# EasyEDA schematic Sheet_1.json
TITLE: Sheet_1; REV: 1.0; Date: 2023-06-02; Sheet: 1/1; Drawn By: Huanbaejh; Company: Your Company
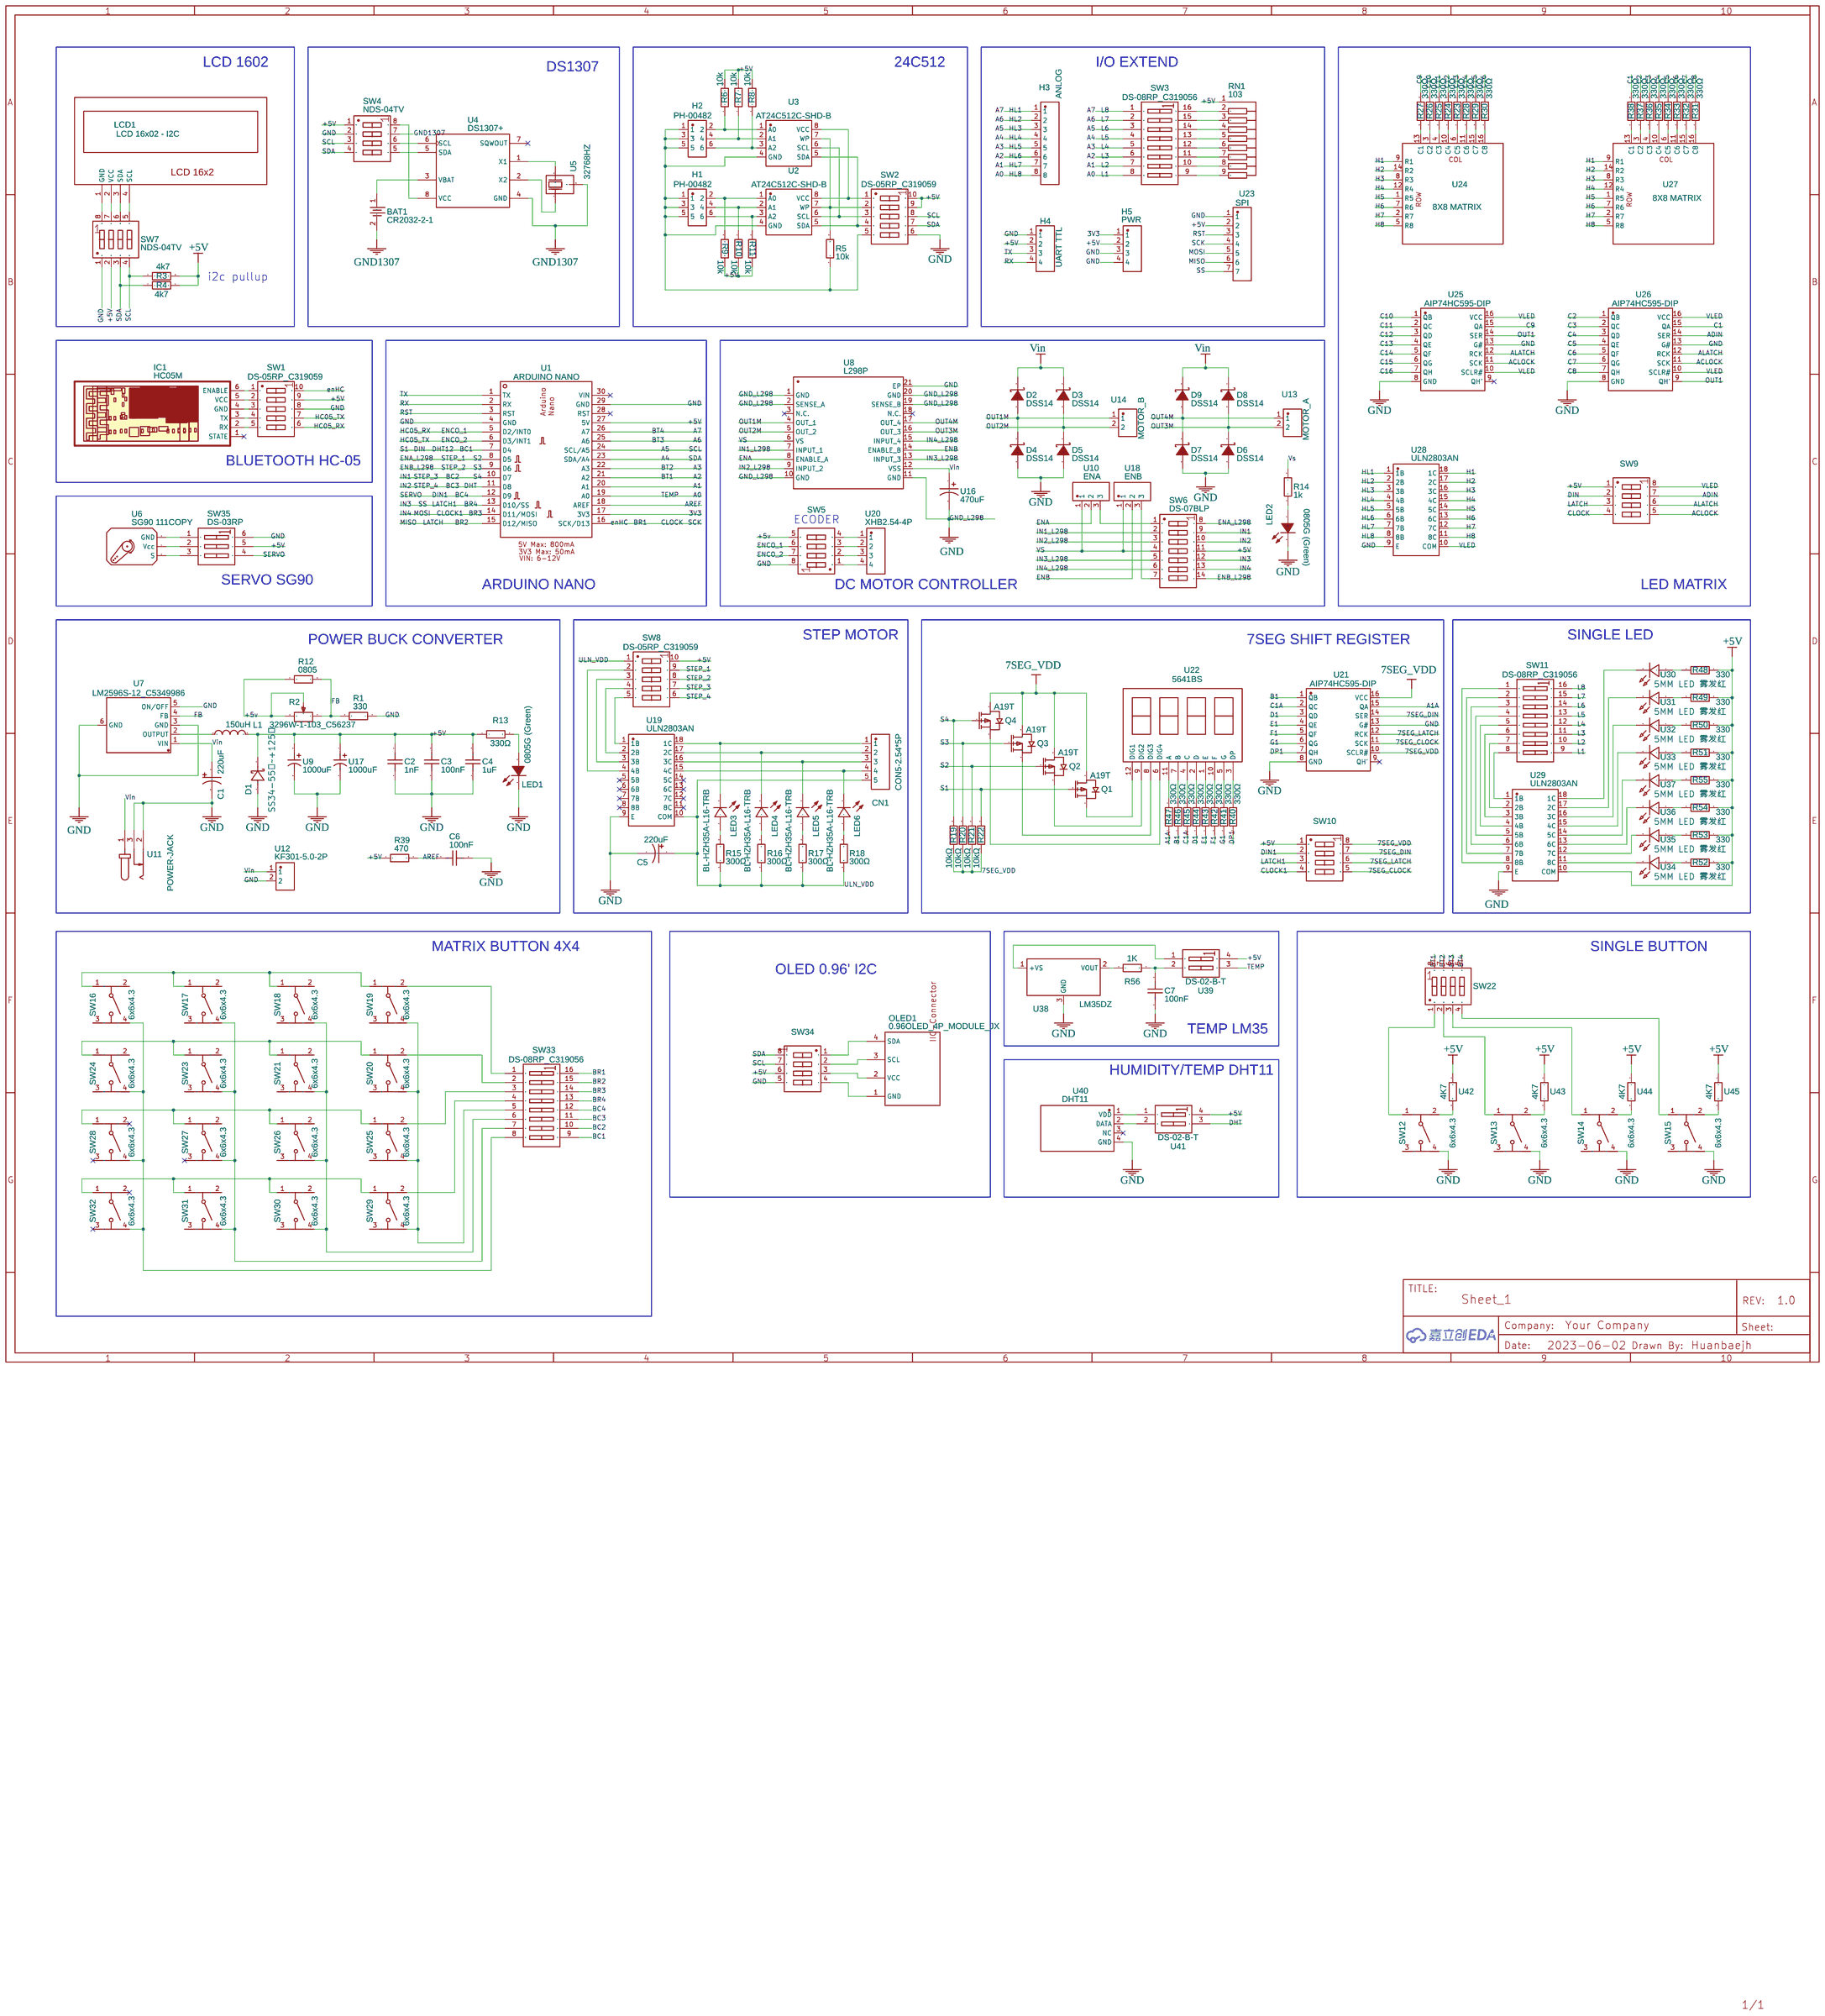
[diagram p0: schematic sheet]

## Parts
BAT1  CR2032-2-1  [BAT-TH_CR2032-2-1]
C1  220uF  [CAP-SMD_BD12.5-L13.0-W13.0-LS13.7-FD]
C2  1nF  [C0805]
C3  100nF  [C0805]
C4  1uF  [C0805]
C5  220uF  [CAP-SMD_BD10.0-L10.3-W10.3-FD]
C6  100nF  [C0805]
C7  100nF  [C0805]
CN1  CON5-2.54*5P  [CONN-TH_5P-P2.54-V]
D1  SS34-55℃~+125℃  [SMA_L4.3-W2.6-LS5.1-RD]
D2  DSS14  [SOD-123_L2.8-W1.8-LS3.7-RD]
D3  DSS14  [SOD-123_L2.8-W1.8-LS3.7-RD]
D4  DSS14  [SOD-123_L2.8-W1.8-LS3.7-RD]
D5  DSS14  [SOD-123_L2.8-W1.8-LS3.7-RD]
D6  DSS14  [SOD-123_L2.8-W1.8-LS3.7-RD]
D7  DSS14  [SOD-123_L2.8-W1.8-LS3.7-RD]
D8  DSS14  [SOD-123_L2.8-W1.8-LS3.7-RD]
D9  DSS14  [SOD-123_L2.8-W1.8-LS3.7-RD]
H1  PH-00482  [HDR-TH_6P-P2.54-V-M-R2-C3-S2.54]
H2  PH-00482  [HDR-TH_6P-P2.54-V-M-R2-C3-S2.54]
H3  ANLOG  [HDR-TH_8P-P2.54-V-M]
H4  UART TTL  [HDR-TH_4P-P2.54-V-F]
H5  PWR  [HDR-TH_4P-P2.54-V-M]
IC1  HC05M  [HC05M]
L1  150uH  [IND-SMD_L12.5-W12.5]
LCD1  LCD 16x02 - I2C  [LCD1602-I2C]
LED1  0805G (Green)  [LED0805-R-RD]
LED2  0805G (Green)  [LED0805-R-RD]
LED3  BL-HZH35A-L16-TRB  [LED0805-R-RD]
LED4  BL-HZH35A-L16-TRB  [LED0805-R-RD]
LED5  BL-HZH35A-L16-TRB  [LED0805-R-RD]
LED6  BL-HZH35A-L16-TRB  [LED0805-R-RD]
OLED1  0.96OLED_4P_MODULE_JX  [0.96OLED_4P]
Q1  A19T  [SOT-23-3_L2.9-W1.3-P1.90-LS2.4-BR]
Q2  A19T  [SOT-23-3_L2.9-W1.3-P1.90-LS2.4-BR]
Q3  A19T  [SOT-23-3_L2.9-W1.3-P1.90-LS2.4-BR]
Q4  A19T  [SOT-23-3_L2.9-W1.3-P1.90-LS2.4-BR]
R1  330  [R0805]
R2  3296W-1-103_C56237  [RES-ADJ-TH_3296W]
R3  4k7  [R0805]
R4  4k7  [R0805]
R5  10k  [R0805]
R6  10k  [R0805]
R7  10k  [R0805]
R8  10k  [R0805]
R9  10k  [R0805]
R10  10k  [R0805]
R11  10k  [R0805]
R12  0805  [R0805]
R13  330Ω  [R0805]
R14  1k  [R0805]
R15  300Ω  [R0805]
R16  300Ω  [R0805]
R17  300Ω  [R0805]
R18  300Ω  [R0805]
R19  10kΩ  [R0805]
R20  10kΩ  [R0805]
R21  10kΩ  [R0805]
R22  10kΩ  [R0805]
R23  330Ω  [R0805]
R24  330Ω  [R0805]
R25  330Ω  [R0805]
R26  330Ω  [R0805]
R27  330Ω  [R0805]
R28  330Ω  [R0805]
R29  330Ω  [R0805]
R30  330Ω  [R0805]
R31  330Ω  [R0805]
R32  330Ω  [R0805]
R33  330Ω  [R0805]
R34  330Ω  [R0805]
R35  330Ω  [R0805]
R36  330Ω  [R0805]
R37  330Ω  [R0805]
R38  330Ω  [R0805]
R39  470  [R0805]
R40  330Ω  [R0805]
R41  330Ω  [R0805]
R42  330Ω  [R0805]
R43  330Ω  [R0805]
R44  330Ω  [R0805]
R45  330Ω  [R0805]
R46  330Ω  [R0805]
R47  330Ω  [R0805]
R48  330  [R0805]
R49  330  [R0805]
R50  330  [R0805]
R51  330  [R0805]
R52  330  [R0805]
R53  330  [R0805]
R54  330  [R0805]
R55  330  [R0805]
R56  1K  [R0805]
RN1  103  [RES-ARRAY-TH_9P-P2.54-D1.0]
SW1  DS-05RP_C319059  [SW-TH_10P-L14.3-W9.9-P2.54-LS7.6]
SW2  DS-05RP_C319059  [SW-TH_10P-L14.3-W9.9-P2.54-LS7.6]
SW3  DS-08RP_C319056  [SW-TH_DS-08XP]
SW4  NDS-04TV  [SW-TH_NDS-04TV]
SW5  NDS-04TV  [SW-TH_NDS-04TV]
SW6  DS-07BLP  [SW-TH_DS-07BLP]
SW7  NDS-04TV  [SW-TH_NDS-04TV]
SW8  DS-05RP_C319059  [SW-TH_10P-L14.3-W9.9-P2.54-LS7.6]
SW9  NDS-04TV  [SW-TH_NDS-04TV]
SW10  NDS-04TV  [SW-TH_NDS-04TV]
SW11  DS-08RP_C319056  [SW-TH_DS-08XP]
SW12  6x6x4.3  [KEY-SMD_4P-L6.2-W6.2-P4.50-LS9.2]
SW13  6x6x4.3  [KEY-SMD_4P-L6.2-W6.2-P4.50-LS9.2]
SW14  6x6x4.3  [KEY-SMD_4P-L6.2-W6.2-P4.50-LS9.2]
SW15  6x6x4.3  [KEY-SMD_4P-L6.2-W6.2-P4.50-LS9.2]
SW16  6x6x4.3  [KEY-SMD_4P-L6.2-W6.2-P4.50-LS9.2]
SW17  6x6x4.3  [KEY-SMD_4P-L6.2-W6.2-P4.50-LS9.2]
SW18  6x6x4.3  [KEY-SMD_4P-L6.2-W6.2-P4.50-LS9.2]
SW19  6x6x4.3  [KEY-SMD_4P-L6.2-W6.2-P4.50-LS9.2]
SW20  6x6x4.3  [KEY-SMD_4P-L6.2-W6.2-P4.50-LS9.2]
SW21  6x6x4.3  [KEY-SMD_4P-L6.2-W6.2-P4.50-LS9.2]
SW22  NDS-04TV  [SW-TH_NDS-04TV]
SW23  6x6x4.3  [KEY-SMD_4P-L6.2-W6.2-P4.50-LS9.2]
SW24  6x6x4.3  [KEY-SMD_4P-L6.2-W6.2-P4.50-LS9.2]
SW25  6x6x4.3  [KEY-SMD_4P-L6.2-W6.2-P4.50-LS9.2]
SW26  6x6x4.3  [KEY-SMD_4P-L6.2-W6.2-P4.50-LS9.2]
SW27  6x6x4.3  [KEY-SMD_4P-L6.2-W6.2-P4.50-LS9.2]
SW28  6x6x4.3  [KEY-SMD_4P-L6.2-W6.2-P4.50-LS9.2]
SW29  6x6x4.3  [KEY-SMD_4P-L6.2-W6.2-P4.50-LS9.2]
SW30  6x6x4.3  [KEY-SMD_4P-L6.2-W6.2-P4.50-LS9.2]
SW31  6x6x4.3  [KEY-SMD_4P-L6.2-W6.2-P4.50-LS9.2]
SW32  6x6x4.3  [KEY-SMD_4P-L6.2-W6.2-P4.50-LS9.2]
SW33  DS-08RP_C319056  [SW-TH_DS-08XP]
SW34  NDS-04TV  [SW-TH_NDS-04TV]
SW35  DS-03RP  [SW-TH_DS-03XP]
U1  ARDUINO NANO  [ARDUNO NANO]
U2  AT24C512C-SHD-B  [SOIC-8_L4.9-W3.9-P1.27-LS6.0-BL]
U3  AT24C512C-SHD-B  [SOIC-8_L4.9-W3.9-P1.27-LS6.0-BL]
U4  DS1307+  [DIP-8_L9.8-W6.6-P2.54-LS7.6-BL]
U5  32768HZ  [CRYSTAL-SMD_32768HZ-CRYSTAL_2-6SMD]
U6  SG90 111COPY  [SG90]
U7  LM2596S-12_C5349986  [TO-263-5_L10.2-W8.9-P1.70-LS15.0-BR]
U8  L298P  [POWERSO20_L15.9-W11.0-P1.27-LS14.2-BL-EP]
U9  1000uF  [CAP-SMD_BD10.0-L10.3-W10.3-LS10.9-FD]
U10  ENA  [HDR-TH_3P-P2.54-V-M-1]
U11  POWER-JACK  [DC-IN-TH_POWER-JACK]
U12  KF301-5.0-2P  [CONN-TH_P5.00_KF301-5.0-2P]
U13  MOTOR_A  [CONN-TH_P5.00_KF301-5.0-2P]
U14  MOTOR_B  [CONN-TH_P5.00_KF301-5.0-2P]
U16  470uF  [CAP-SMD_BD10.0-L10.3-W10.3-LS10.9-FD]
U17  1000uF  [CAP-SMD_BD10.0-L10.3-W10.3-LS10.9-FD]
U18  ENB  [HDR-TH_3P-P2.54-V-M-1]
U19  ULN2803AN  [DIP-18_L23.0-W6.5-P2.54-LS7.6-BL]
U20  XHB2.54-4P  [CONN-TH_4P-P2.54-XH2.54-LI-4P]
U21  AIP74HC595-DIP  [DIP-16_L19.8-W6.5-P2.54-LS7.6-BL]
U22  5641BS  [KEM-5641-BSR]
U23  SPI  [HDR-TH_7P-P2.54-V-M]
U24  8X8 MATRIX  [1088AS_DOTMATRIX]
U25  AIP74HC595-DIP  [DIP-16_L19.8-W6.5-P2.54-LS7.6-BL]
U26  AIP74HC595-DIP  [DIP-16_L19.8-W6.5-P2.54-LS7.6-BL]
U27  8X8 MATRIX  [1088AS_DOTMATRIX]
U28  ULN2803AN  [DIP-18_L23.0-W6.5-P2.54-LS7.6-BL]
U29  ULN2803AN  [DIP-18_L23.0-W6.5-P2.54-LS7.6-BL]
U30  5MM LED 雾发红  [LED-TH_BD5.0-P2.54-FD]
U31  5MM LED 雾发红  [LED-TH_BD5.0-P2.54-FD]
U32  5MM LED 雾发红  [LED-TH_BD5.0-P2.54-FD]
U33  5MM LED 雾发红  [LED-TH_BD5.0-P2.54-FD]
U34  5MM LED 雾发红  [LED-TH_BD5.0-P2.54-FD]
U35  5MM LED 雾发红  [LED-TH_BD5.0-P2.54-FD]
U36  5MM LED 雾发红  [LED-TH_BD5.0-P2.54-FD]
U37  5MM LED 雾发红  [LED-TH_BD5.0-P2.54-FD]
U38  LM35DZ  [TO-92-3_L4.9-W3.7-P1.27-L]
U39  DS-02-B-T  [SW-TH_DS-02-B-T]
U40  DHT11  [SENSOR-TH_DHT11]
U41  DS-02-B-T  [SW-TH_DS-02-B-T]
U42  4K7  [R0805]
U43  4K7  [R0805]
U44  4K7  [R0805]
U45  4K7  [R0805]

## Library data of the parts
BAT1 = CR2032-2-1: Supplier: LCSC; Supplier Part: C9900018737; Manufacturer: null; JLCPCB Part Class: Extended Part; Contributor: lcsc
C1 = VUK221M1HTR-1316: Supplier: LCSC; Supplier Part: C335057; Manufacturer: lelon(立隆); Contributor: LCSC; JLCPCB Part Class: Extended Part
C2 = C0805X102K101T: Supplier: LCSC; Supplier Part: C559288; Manufacturer: IHHEC(禾伸堂); Contributor: LCSC; JLCPCB Part Class: Extended Part
C3 C6 C7 = 0805B104K101AT: Supplier: LCSC; Supplier Part: C3037660; Manufacturer: FH(风华); Contributor: lcsc
C4 = GRM219R71E105KA88D: Supplier: LCSC; Manufacturer: muRata(村田); Supplier Part: C86035; JLCPCB Part Class: Extended Part
C5 = EEEFC1C221AP: Supplier: LCSC; Supplier Part: C401620; Manufacturer: PANASONIC(松下); Contributor: LCSC; JLCPCB Part Class: Extended Part
CN1 = CON5-2.54*5P: Supplier: LCSC; Supplier Part: C9900003233; Manufacturer: null; Contributor: LCSC; JLCPCB Part Class: Extended Part
D1 = SS34-55℃&#126;+125℃: Supplier: LCSC; Supplier Part: C9900022445; Manufacturer: null; Contributor: lcsc; JLCPCB Part Class: Extended Part
D2-D9 = DSS14: Supplier: LCSC; Manufacturer: 星海; Supplier Part: C59293; JLCPCB Part Class: Extended Part
H1 H2 = PH-00482: Supplier: LCSC; Supplier Part: C2685163; Manufacturer: Liansheng(连盛); Contributor: LCSC; JLCPCB Part Class: Extended Part
H3 = X5511WV-08-C396D43-1220: Supplier: LCSC; Supplier Part: C2883395; Manufacturer: XKB Connectivity(中国星坤); link: https://atta.szlcsc.com/upload/public/pdf/source/20211009/7D13F627EAEF227E7F3D2A55C463773D.pdf; Contributor: LCSC
H4 = A2541HWV-4P_C5144876: Supplier: LCSC; Supplier Part: C5144876; Manufacturer: CJT(长江连接器); Manufacturer Part: A2541HWV-4P; link: https://atta.szlcsc.com/upload/public/pdf/source/20220901/D894375BE80FDD2AC7E5A4631E2A9071.pdf; Contributor: lcsc; JLCPCB Part Class: Extended Part
H5 = DZ254R-11-04-63: Supplier: LCSC; Supplier Part: C2935910; Manufacturer: DEALON(德艺隆); Contributor: LCSC; JLCPCB Part Class: Extended Part
IC1 = HC05M: Contributor: emiliopisa
L1 = SWRH1205B-151MT: Supplier: LCSC; Supplier Part: C127794; Manufacturer: Sunlord(顺络); Contributor: LCSC; JLCPCB Part Class: Extended Part
LCD1 = LCD 16x02 - I2C: Supplier: LCSC; Manufacturer: LONTECH; Manufacturer Part: LCM1602K-NSW-BBW-33V33; Supplier Part: C83272; JLCPCB Part Class: Extended Part; Contributor: sonumehtaskr
LED1 LED2 = 0805G (Green): Supplier: LCSC; Manufacturer: KENTO; Manufacturer Part: KT-0805翠绿; Supplier Part: C2297; JLCPCB Part Class: Basic Part
LED3-LED6 = BL-HZH35A-L16-TRB: Supplier: LCSC; Supplier Part: C138554; Manufacturer: BrtLed(佰鸿); Contributor: LCSC; JLCPCB Part Class: Extended Part
OLED1 = 0.96OLED_4P_MODULE_JX: Supplier: LCSC; Supplier Part: C9900004566; Manufacturer: null; Contributor: LCSC; JLCPCB Part Class: Extended Part
Q1-Q4 = FS3401MLT1 A19T: Supplier: LCSC; Supplier Part: C2936839; Manufacturer: FOSAN(富信); Manufacturer Part: FS3401M; Contributor: LCSC; JLCPCB Part Class: Extended Part
R1 = CR0805F833R2G: Supplier: LCSC; Supplier Part: C101670; Manufacturer: LIZ(丽智电子); Resistance (Ohms): 33.2; Contributor: LCSC; JLCPCB Part Class: Extended Part
R2 = 3296W-1-103_C56237: Supplier Part: C56237; Supplier: LCSC; Manufacturer: ReliaPro; Manufacturer Part: 3296W-1-103; JLCPCB Part Class: Extended Part
R3 R4 = AECR0805F24K0K9: Supplier: LCSC; Supplier Part: C352238; Manufacturer: RESI(开步睿思）; Resistance (Ohms): 24K; Contributor: LCSC; JLCPCB Part Class: Extended Part
R5-R11 = CR0805F12K7P05: Supplier: LCSC; Supplier Part: C245233; Manufacturer: EVER OHMS(天二科技); Manufacturer Part: CR0805F12K7P05Z; Resistance (Ohms): 12.7K; Contributor: LCSC; JLCPCB Part Class: Extended Part
R12 = 0805: Supplier: LCSC; Supplier Part: C9900012715; Manufacturer: null; link: https://atta.szlcsc.comnull; Contributor: LCSC; JLCPCB Part Class: Extended Part
R13 R14 = AECR0805F130RK9: Supplier: LCSC; Supplier Part: C352269; Manufacturer: RESI(开步睿思）; Resistance (Ohms): 130; Contributor: LCSC; JLCPCB Part Class: Extended Part
R15-R18 = AECR0805F300RK9: Supplier: LCSC; Supplier Part: C352224; Manufacturer: RESI(开步睿思）; Resistance (Ohms): 300; Contributor: LCSC; JLCPCB Part Class: Extended Part
R19-R22 = 0805WAD1002T5E: Supplier: LCSC; Supplier Part: C169071; Manufacturer: UNI-ROYAL(厚声); Resistance (Ohms): 10K; Contributor: LCSC; JLCPCB Part Class: Extended Part
R23-R38 R40-R47 = CR0805J80331G: Supplier: LCSC; Manufacturer: LIZ(丽智电子); Resistance (Ohms): 330; Supplier Part: C101994; JLCPCB Part Class: Extended Part
R39 R56 = CR0805-FX-47R0ELF: Supplier: LCSC; Supplier Part: C204532; Manufacturer: BOURNS; Contributor: LCSC; JLCPCB Part Class: Extended Part; Resistance: 47Ω
R48-R55 = AECR0805F160RK9: Supplier: LCSC; Supplier Part: C352264; Manufacturer: RESI(开步睿思）; Resistance (Ohms): 160; Contributor: LCSC; JLCPCB Part Class: Extended Part
RN1 = RAA09331G: Supplier: LCSC; Supplier Part: C353617; Manufacturer: Monec(鑫汇); Contributor: LCSC; Resistance (Ohms): 330; JLCPCB Part Class: Extended Part
SW1 SW2 SW8 = DS-05RP_C319059: Supplier: LCSC; Supplier Part: C319059; Manufacturer: XKB Connectivity(中国星坤); Manufacturer Part: DS-05RP; Contributor: LCSC; JLCPCB Part Class: Extended Part
SW3 SW11 SW33 = DS-08RP_C319056: Supplier: LCSC; Supplier Part: C319056; Manufacturer: XKB Connectivity(中国星坤); Manufacturer Part: DS-08RP; Contributor: LCSC; JLCPCB Part Class: Extended Part
SW4 SW5 SW7 SW9 SW10 SW22 SW34 = NDS-04TV: Supplier: LCSC; Supplier Part: C699468; Manufacturer: 圜达; Contributor: LCSC; JLCPCB Part Class: Extended Part
SW6 = DS-07BLP: Supplier: LCSC; Supplier Part: C692505; Manufacturer: XKB Connectivity(中国星坤); Contributor: LCSC; JLCPCB Part Class: Extended Part
SW12-SW21 SW23-SW32 = 6x6x4.3: Supplier: LCSC; Supplier Part: C10913; Manufacturer: Made in China; Contributor: LCSC
SW35 = DS-03RP: Supplier: LCSC; Manufacturer: 韩国韩荣; Contributor: LCSC; Supplier Part: C129060; JLCPCB Part Class: Extended Part
U1 = ARDUINO NANO: Contributor: Tomáš Michal
U2 U3 = AT24C512C-SHD-B: Supplier: LCSC; Supplier Part: C615464; Manufacturer: MICROCHIP(美国微芯); Contributor: LCSC; JLCPCB Part Class: Extended Part
U4 = DS1307+: Supplier: LCSC; Manufacturer: ADI(亚德诺)/MAXIM(美信); Supplier Part: C59267; JLCPCB Part Class: Extended Part
U5 = 32768HZ-CRYSTAL_2X6SMD: Supplier: LCSC; Supplier Part: C9900008919; Manufacturer: null; Manufacturer Part: 32768Hz-CRYSTAL_2x6SMD; Contributor: LCSC; JLCPCB Part Class: Extended Part
U6 = SG90 111COPY: Contributor: CARLOS DANIEL JIMENEZ PAZ
U7 = LM2596S-12_C5349986: Supplier: LCSC; Supplier Part: C5349986; Manufacturer: HXY MOSFET(华轩阳电子); Manufacturer Part: LM2596S-12; link: https://atta.szlcsc.com/upload/public/pdf/source/20230111/199BC35A7A4D0647B85E7DE5CE9FEA7F.pdf; Contributor: lcsc
U8 = L298P: Supplier Part: C85595; Supplier: LCSC; Manufacturer: ST(意法半导体); JLCPCB Part Class: Extended Part
U9 U17 = 10TZV1000M10X10.5: Supplier: LCSC; Supplier Part: C2163745; Manufacturer: rubycon(红宝石); link: https://atta.szlcsc.com/upload/public/pdf/source/20210719/C2163745_E32C00BBD93AE6579519C2DF3BBB8F71.pdf; Contributor: lcsc
U10 U18 = PEC03SAAN: Supplier: LCSC; Supplier Part: C9900020756; Manufacturer: null; JLCPCB Part Class: Extended Part; Contributor: lcsc
U11 = POWER-JACK: Supplier: LCSC; Supplier Part: C9900001795; Manufacturer: null; JLCPCB Part Class: Extended Part; Contributor: LCSC
U12-U14 = KF301-5.0-2P: Supplier: LCSC; Supplier Part: C474881; Manufacturer: KEFA(科发); Contributor: LCSC; JLCPCB Part Class: Extended Part
U16 = 10SGV470M10X10.5: Supplier: LCSC; Supplier Part: C1896542; Manufacturer: rubycon(红宝石); link: https://atta.szlcsc.com/upload/public/pdf/source/20210527/C1896542_206198ED83BCA4D101CF7A0F894989D6.pdf; Contributor: lcsc
U19 U28 U29 = ULN2803AN: Supplier: LCSC; Supplier Part: C481685; Manufacturer: HTC; Contributor: LCSC; JLCPCB Part Class: Extended Part
U20 = XHB2.54-4P: Supplier: LCSC; Supplier Part: C9900014704; Manufacturer: null; Contributor: lcsc; JLCPCB Part Class: Extended Part
U21 U25 U26 = AIP74HC595-DIP: Supplier: LCSC; Manufacturer: I-CORE(中微爱芯); Supplier Part: C112387; JLCPCB Part Class: Extended Part
U22 = KEM-5641-BSR: Manufacturer: Keming; Contributor: nedkisa
U23 = PZ254-1-07-Z-C: Supplier: LCSC; Supplier Part: C5156434; Manufacturer: HCTL(华灿天禄); link: https://atta.szlcsc.com/upload/public/pdf/source/20220902/6A77F1CA17172E97499F3A4004CED624.pdf; Contributor: lcsc
U24 U27 = 8X8 MATRIX: Manufacturer Part: 1088AS_dotmatrix; Contributor: Dorin Nicoara
U30-U37 = 5MM LED 雾发红: Supplier: LCSC; Supplier Part: C9900034380; Manufacturer: null; Manufacturer Part: 5mm LED 雾发红; link: 2022-11-07/459554A/14e8213d67a04a3dacf5c4dc7c3d6b7a/C2764903.pdf; JLCPCB Part Class: Extended Part; Contributor: lcsc
U38 = LM35DZ: Supplier: LCSC; Manufacturer: TI(德州仪器); Manufacturer Part: LM35DZ/NOPB; Supplier Part: C12165; JLCPCB Part Class: Extended Part
U39 U41 = DS-02-B-T: Supplier: LCSC; Supplier Part: C5162136; Manufacturer: 康深; link: https://atta.szlcsc.com/upload/public/pdf/source/20220913/02FD6107DF65EF7139217537043EDF4C.pdf; Contributor: lcsc
U40 = DHT11: Supplier: LCSC; Supplier Part: C117051; Manufacturer: 广州奥松; Contributor: LCSC; JLCPCB Part Class: Extended Part
U42-U45 = CR0805-JW-104ELF: Supplier: LCSC; Supplier Part: C9900011175; Manufacturer: null; JLCPCB Part Class: Extended Part; Contributor: lcsc

## Nets
3V3: H5.1 U1.17(3V3)
+5V: C2.2 C3.2 C4.2 D1.1(K) H4.2 H5.2 L1.2 R3.2 R4.2 R6.2 R7.2 R8.2 R9.2 R10.2 R11.2 R13.1 R39.1 R48.2 R49.2 R50.2 R51.2 R52.2 R53.2 R54.2 R55.2 RN1.1 SW1.9(PIN9) SW2.9(PIN9) SW2.10(PIN10) SW4.1(PIN1) SW6.11(PIN11) SW7.2(PIN2) SW8.10(PIN10) SW9.1(PIN1) SW10.1(PIN1) SW34.6(PIN6) SW35.5(A5) U1.27(5V) U9.1 U17.1 U23.2 U29.10(COM) U39.4(B3) U41.4(B3) U42.1 U43.1 U44.1 U45.1
+5v: R2.2 R2.3 R12.1 SW5.5(PIN5)
GND: C1.2 C2.1 C3.1 C4.1 C5.2 C6.1 C7.2 D1.2(A) D4.2(A) D5.2(A) D6.2(A) D7.2(A) H4.1 H5.3 H5.4 LED1.2(K) LED2.2(K) R1.1 SW1.8(PIN8) SW2.6(PIN6) SW4.2(PIN2) SW5.8(PIN8) SW7.1(PIN1) SW12.4 SW13.4 SW14.4 SW15.4 SW34.5(PIN5) SW35.6(A6) U1.4(GND) U1.29(GND) U7.3(GND) U7.5(ON/OFF) U7.6(GND) U8.1(GND) U8.2(SENSE A) U8.10(GND) U8.11(GND) U8.19(SENSE B) U8.20(GND) U8.21(EP) U9.2 U11.2 U11.3 U12.2 U16.2 U17.2 U19.9(E) U21.8(GND) U21.13(G#) U23.1 U25.8(GND) U25.13(G#) U26.8(GND) U26.13(G#) U28.9(E) U29.9(E) U38.3(GND) U40.4(GND)
GND1307: BAT1.2 SW4.7(PIN7) U4.4(GND) U5.3(GND)
Vin: C1.1 D2.1(K) D3.1(K) D8.1(K) D9.1(K) U7.1(VIN) U8.12(VSS) U11.1 U12.1 U16.1
7SEG_CLOCK: SW10.5(PIN5) U21.11(SCK)
7SEG_DIN: SW10.7(PIN7) U21.14(SER)
7SEG_LATCH: SW10.6(PIN6) U21.12(RCK)
7SEG_VDD: Q1.3(D) Q2.3(D) Q3.3(D) Q4.3(D) R19.1 R20.1 R21.1 R22.1 SW10.8(PIN8) U21.10(SCLR#) U21.16(VCC)
A0: H3.8 SW3.8(A8) SW11.9 U1.19(A0) U28.8(8B) U39.3(A3)
A1: H3.7 SW3.7(A7) SW11.10 U1.20(A1) U28.7(7B)
A1A: R47.1 U21.15(QA)
A2: H3.6 SW3.6(A6) SW11.11 SW22.8(PIN8) U1.21(A2) U28.6(6B)
A3: H3.5 SW3.5(A5) SW11.12 SW22.7(PIN7) U1.22(A3) U28.5(5B)
A4: H3.4 R4.1 SW2.7(PIN7) SW3.4(A4) SW4.4(PIN4) SW7.3(PIN3) SW11.13 SW34.8(PIN8) U1.23(SDA/A4) U28.4(4B)
A5: H3.3 R3.1 SW2.8(PIN8) SW3.3(A3) SW4.3(PIN3) SW7.4(PIN4) SW11.14 SW34.7(PIN7) U1.24(SCL/A5) U28.3(3B)
A6: H3.2 SW3.2(A2) SW11.15 SW22.6(PIN6) U1.25(A6) U28.2(2B)
A7: H3.1 SW3.1(A1) SW11.16 SW22.5(PIN5) U1.26(A7) U28.1(1B)
ACLOCK: SW9.5(PIN5) U25.11(SCK) U26.11(SCK)
ADIN: SW9.7(PIN7) U26.14(SER)
ALATCH: SW9.6(PIN6) U25.12(RCK) U26.12(RCK)
AREF: C6.2 R39.2 U1.18(AREF)
B1: R46.1 U21.1(QB)
BC1: Q1.1(G) R22.2 SW9.2(PIN2) SW33.9 U1.7(D4)
BC2: Q4.1(G) R19.2 SW6.9(PIN9) SW8.7(PIN7) SW33.10 U1.10(D7)
BC3: SW6.10(PIN10) SW8.6(PIN6) SW33.11 U1.11(D8) U41.3(A3)
BC4: SW10.2(PIN2) SW33.12 SW35.4(A4) U1.12(D9)
BR1: SW1.10(PIN10) SW9.4(PIN4) SW33.16 U1.16(SCK/D13) U23.4
BR2: SW9.3(PIN3) SW33.15 U1.15(D12/MISO) U23.6
BR3: SW6.13(PIN13) SW10.4(PIN4) SW33.14 U1.14(D11/MOSI) U23.5
BR4: SW6.12(PIN12) SW10.3(PIN3) SW33.13 U1.13(D10/SS) U23.7
C1: R38.2 U26.15(QA)
C1A: R45.1 U21.2(QC)
C2: R37.2 U26.1(QB)
C3: R36.2 U26.2(QC)
C4: R35.2 U26.3(QD)
C5: R34.2 U26.4(QE)
C6: R33.2 U26.5(QF)
C7: R32.2 U26.6(QG)
C8: R31.2 U26.7(QH)
C9: R27.2 U25.15(QA)
C10: R26.2 U25.1(QB)
C11: R25.2 U25.2(QC)
C12: R24.2 U25.3(QD)
C13: R23.2 U25.4(QE)
C14: R28.2 U25.5(QF)
C15: R29.2 U25.6(QG)
C16: R30.2 U25.7(QH)
D1: R44.1 U21.3(QD)
DP1: R40.1 U21.7(QH)
E1: R43.1 U21.4(QE)
ENA: U8.8(ENABLE A) U10.2
ENA_L298: Q2.1(G) R21.2 SW6.8(PIN8) SW8.9(PIN9) U1.8(D5)
ENB: U8.14(ENABLE B) U18.2
ENB_L298: Q3.1(G) R20.2 SW6.14(PIN14) SW8.8(PIN8) U1.9(D6)
ENCO_1: SW1.6(PIN6) SW5.6(PIN6) U1.5(D2/INT0)
ENCO_2: SW1.7(PIN7) SW5.7(PIN7) U1.6(D3/INT1)
F1: R42.1 U21.5(QF)
FB: R1.2 R2.1 R12.2 U7.4(FB)
G1: R41.1 U21.6(QG)
H1: U24.9(R1) U27.9(R1) U28.18(1C)
H2: U24.14(R2) U27.14(R2) U28.17(2C)
H3: U24.8(R3) U27.8(R3) U28.16(3C)
H4: U24.12(R4) U27.12(R4) U28.15(4C)
H5: U24.1(R5) U27.1(R5) U28.14(5C)
H6: U24.7(R6) U27.7(R6) U28.13(6C)
H7: U24.2(R7) U27.2(R7) U28.12(7C)
H8: U24.5(R8) U27.5(R8) U28.11(8C)
IN1_L298: SW6.2(PIN2) U8.7(INPUT 1)
IN2_L298: SW6.3(PIN3) U8.9(INPUT 2)
IN3_L298: SW6.5(PIN5) U8.13(INPUT 3)
IN4_L298: SW6.6(PIN6) U8.15(INPUT 4)
OUT1: U25.14(SER) U26.9(QH')
OUT1M: D2.2(A) D4.1(K) U8.4(OUT 1) U14.1
OUT2M: D3.2(A) D5.1(K) U8.5(OUT 2) U14.2
OUT3M: D6.1(K) D8.2(A) U8.16(OUT 3) U13.2
OUT4M: D7.1(K) D9.2(A) U8.17(OUT 4) U13.1
RST: U1.3(RST) U23.3
RX: H4.4 U1.2(RX)
TX: H4.3 U1.1(TX)
ULN_VDD: C5.1 CN1.5 R15.1 R16.1 R17.1 R18.1 SW8.1(PIN1) U19.10(COM)
VLED: SW9.8(PIN8) U25.10(SCLR#) U25.16(VCC) U26.10(SCLR#) U26.16(VCC) U28.10(COM)
VS: SW6.4(PIN4) U8.6(VS) U10.1 U18.1
Vs: R14.2
Net-(BAT1-1): BAT1.1 U4.3(VBAT)
Net-(C7-1): C7.1 R56.2 U39.2(A2)
Net-(CN1-1): CN1.1 LED3.2(-) U19.18(1C)
Net-(CN1-2): CN1.2 LED4.2(-) U19.17(2C)
Net-(CN1-3): CN1.3 LED5.2(-) U19.16(3C)
Net-(CN1-4): CN1.4 LED6.2(-) U19.15(4C)
Net-(H1-1): H1.1 H1.3 H1.5 H2.1 H2.3 H2.5 R5.1 SW2.5(PIN5) U2.4(GND) U3.4(GND)
Net-(H1-2): H1.2 R9.1 U2.1(A0)
Net-(H1-4): H1.4 R10.1 U2.2(A1)
Net-(H1-6): H1.6 R11.1 U2.3(A2)
Net-(H2-2): H2.2 R6.1 U3.1(A0)
Net-(H2-4): H2.4 R7.1 U3.2(A1)
Net-(H2-6): H2.6 R8.1 U3.3(A2)
Net-(IC1-2): IC1.2(RX) SW1.5(PIN5)
Net-(IC1-3): IC1.3(TX) SW1.4(PIN4)
Net-(IC1-4): IC1.4(GND) SW1.3(PIN3)
Net-(IC1-5): IC1.5(VCC) SW1.2(PIN2)
Net-(IC1-6): IC1.6(ENABLE) SW1.1(PIN1)
Net-(L1-1): L1.1 U7.2(OUTPUT)
Net-(LCD1-1): LCD1.1(GND) SW7.8(PIN8)
Net-(LCD1-2): LCD1.2(VCC) SW7.7(PIN7)
Net-(LCD1-3): LCD1.3(SDA) SW7.6(PIN6)
Net-(LCD1-4): LCD1.4(SCL) SW7.5(PIN5)
Net-(LED1-1): LED1.1(A) R13.2
Net-(LED2-1): LED2.1(A) R14.1
Net-(LED3-1): LED3.1(+) R15.2
Net-(LED4-1): LED4.1(+) R16.2
Net-(LED5-1): LED5.1(+) R17.2
Net-(LED6-1): LED6.1(+) R18.2
Net-(OLED1-1): OLED1.1(GND) SW34.4(PIN4)
Net-(OLED1-2): OLED1.2(VCC) SW34.3(PIN3)
Net-(OLED1-3): OLED1.3(SCL) SW34.2(PIN2)
Net-(OLED1-4): OLED1.4(SDA) SW34.1(PIN1)
Net-(Q1-2): Q1.2(S) U22.12(DIG1)
Net-(Q2-2): Q2.2(S) U22.9(DIG2)
Net-(Q3-2): Q3.2(S) U22.8(DIG3)
Net-(Q4-2): Q4.2(S) U22.6(DIG4)
Net-(R5-2): R5.2 SW2.2(PIN2) U2.7(WP) U3.7(WP)
Net-(R23-1): R23.1 U24.6(C5)
Net-(R24-1): R24.1 U24.10(C4)
Net-(R25-1): R25.1 U24.4(C3)
Net-(R26-1): R26.1 U24.3(C2)
Net-(R27-1): R27.1 U24.13(C1)
Net-(R28-1): R28.1 U24.11(C6)
Net-(R29-1): R29.1 U24.15(C7)
Net-(R30-1): R30.1 U24.16(C8)
Net-(R31-1): R31.1 U27.16(C8)
Net-(R32-1): R32.1 U27.15(C7)
Net-(R33-1): R33.1 U27.11(C6)
Net-(R34-1): R34.1 U27.6(C5)
Net-(R35-1): R35.1 U27.10(C4)
Net-(R36-1): R36.1 U27.4(C3)
Net-(R37-1): R37.1 U27.3(C2)
Net-(R38-1): R38.1 U27.13(C1)
Net-(R40-2): R40.2 U22.3(DP)
Net-(R41-2): R41.2 U22.5(G)
Net-(R42-2): R42.2 U22.10(F)
Net-(R43-2): R43.2 U22.1(E)
Net-(R44-2): R44.2 U22.2(D)
Net-(R45-2): R45.2 U22.4(C)
Net-(R46-2): R46.2 U22.7(B)
Net-(R47-2): R47.2 U22.11(A)
Net-(R48-1): R48.1 U30.1(+)
Net-(R49-1): R49.1 U31.1(+)
Net-(R50-1): R50.1 U32.1(+)
Net-(R51-1): R51.1 U33.1(+)
Net-(R52-1): R52.1 U34.1(+)
Net-(R53-1): R53.1 U35.1(+)
Net-(R54-1): R54.1 U36.1(+)
Net-(R55-1): R55.1 U37.1(+)
Net-(R56-1): R56.1 U38.2(VOUT)
Net-(RN1-2): RN1.2 SW3.16
Net-(RN1-3): RN1.3 SW3.15
Net-(RN1-4): RN1.4 SW3.14
Net-(RN1-5): RN1.5 SW3.13
Net-(RN1-6): RN1.6 SW3.12
Net-(RN1-7): RN1.7 SW3.11
Net-(RN1-8): RN1.8 SW3.10
Net-(RN1-9): RN1.9 SW3.9
Net-(SW2-1): SW2.1(PIN1) U2.8(VCC) U3.8(VCC)
Net-(SW2-3): SW2.3(PIN3) U2.6(SCL) U3.6(SCL)
Net-(SW2-4): SW2.4(PIN4) U2.5(SDA) U3.5(SDA)
Net-(SW4-5): SW4.5(PIN5) U4.5(SDA)
Net-(SW4-6): SW4.6(PIN6) U4.6(SCL)
Net-(SW4-8): SW4.8(PIN8) U4.8(VCC)
Net-(SW5-1): SW5.1(PIN1) U20.4
Net-(SW5-2): SW5.2(PIN2) U20.3
Net-(SW5-3): SW5.3(PIN3) U20.2
Net-(SW5-4): SW5.4(PIN4) U20.1
Net-(SW6-1): SW6.1(PIN1) U10.3
Net-(SW6-7): SW6.7(PIN7) U18.3
Net-(SW8-2): SW8.2(PIN2) U19.4(4B)
Net-(SW8-3): SW8.3(PIN3) U19.3(3B)
Net-(SW8-4): SW8.4(PIN4) U19.2(2B)
Net-(SW8-5): SW8.5(PIN5) U19.1(1B)
Net-(SW11-1): SW11.1(A1) U29.8(8B)
Net-(SW11-2): SW11.2(A2) U29.7(7B)
Net-(SW11-3): SW11.3(A3) U29.6(6B)
Net-(SW11-4): SW11.4(A4) U29.5(5B)
Net-(SW11-5): SW11.5(A5) U29.4(4B)
Net-(SW11-6): SW11.6(A6) U29.3(3B)
Net-(SW11-7): SW11.7(A7) U29.2(2B)
Net-(SW11-8): SW11.8(A8) U29.1(1B)
Net-(SW12-1): SW12.1 SW22.1(PIN1)
Net-(SW12-2): SW12.2 U42.2
Net-(SW13-1): SW13.1 SW22.2(PIN2)
Net-(SW13-2): SW13.2 U43.2
Net-(SW14-1): SW14.1 SW22.3(PIN3)
Net-(SW14-2): SW14.2 U44.2
Net-(SW15-1): SW15.1 SW22.4(PIN4)
Net-(SW15-2): SW15.2 U45.2
Net-(SW16-1): SW16.1 SW17.1 SW18.1 SW19.1
Net-(SW16-4): SW16.4 SW24.4 SW28.4 SW32.4 SW33.8(A8)
Net-(SW17-4): SW17.4 SW23.4 SW27.4 SW31.4 SW33.7(A7)
Net-(SW18-4): SW18.4 SW21.4 SW26.4 SW30.4 SW33.6(A6)
Net-(SW19-2): SW19.2 SW33.1(A1)
Net-(SW19-4): SW19.4 SW20.4 SW25.4 SW29.4 SW33.5(A5)
Net-(SW20-1): SW20.1 SW21.1 SW23.1 SW24.1
Net-(SW20-2): SW20.2 SW33.2(A2)
Net-(SW25-1): SW25.1 SW26.1 SW27.1 SW28.1
Net-(SW25-2): SW25.2 SW33.3(A3)
Net-(SW29-1): SW29.1 SW30.1 SW31.1 SW32.1
Net-(SW29-2): SW29.2 SW33.4(A4)
Net-(SW35-1): SW35.1(A1) U6.3(GND)
Net-(SW35-2): SW35.2(A2) U6.2(Vcc)
Net-(SW35-3): SW35.3(A3) U6.1(S)
Net-(U4-1): U4.1(X1) U5.1(OSC1)
Net-(U4-2): U4.2(X2) U5.2(OSC2)
Net-(U29-11): U29.11(8C) U34.2(-)
Net-(U29-12): U29.12(7C) U35.2(-)
Net-(U29-13): U29.13(6C) U36.2(-)
Net-(U29-14): U29.14(5C) U37.2(-)
Net-(U29-15): U29.15(4C) U33.2(-)
Net-(U29-16): U29.16(3C) U32.2(-)
Net-(U29-17): U29.17(2C) U31.2(-)
Net-(U29-18): U29.18(1C) U30.2(-)
Net-(U38-1): U38.1(+VS) U39.1(A1)
Net-(U40-1): U40.1(VDD) U41.1(A1)
Net-(U40-2): U40.2(DATA) U41.2(A2)

Not connected (* = marked no-connect by the designer): IC1 1(STATE)*; SW12 3; SW13 3; SW14 3; SW15 3; SW16 2 3; SW17 2 3; SW18 2 3; SW19 3; SW20 3; SW21 2 3; SW23 2 3; SW24 2 3; SW25 3; SW26 2 3; SW27 2 3; SW28 2* 3*; SW29 3; SW30 2 3; SW31 2 3; SW32 2* 3*; U1 28(RST)* 30(VIN)*; U4 7(SQWOUT)*; U8 3(N.C.)* 18(N.C.)*; U19 5(5B)* 6(6B)* 7(7B)* 8(8B)* 11(8C)* 12(7C)* 13(6C)* 14(5C)*; U21 9(QH')*; U25 9(QH')*; U40 3(NC)*

## Notes on the sheet
- LCD 1602
- DS1307
- 24C512
- I/O EXTEND
- i2c pullup
- BLUETOOTH HC-05
- ECODER
- SERVO SG90
- ARDUINO NANO
- DC MOTOR CONTROLLER
- LED MATRIX
- POWER BUCK CONVERTER
- STEP MOTOR
- 7SEG SHIFT REGISTER
- SINGLE LED
- MATRIX BUTTON 4X4
- SINGLE BUTTON
- OLED 0.96' I2C
- TEMP LM35
- HUMIDITY/TEMP DHT11
